# Altium schematic sheet v2.SchDoc
size A3
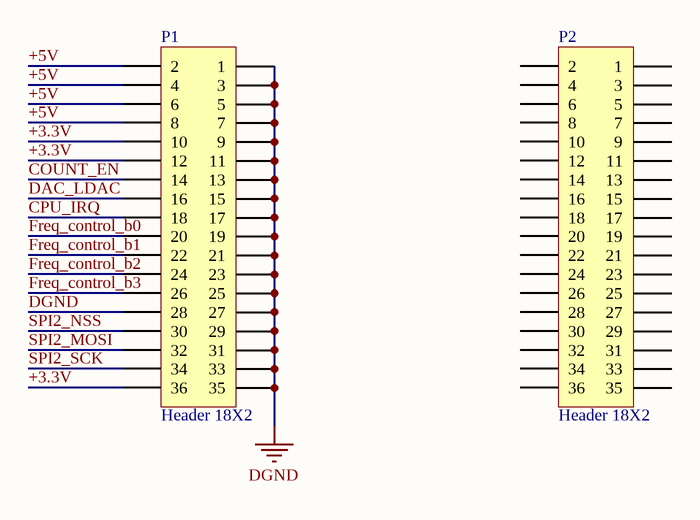
[diagram p0: v2.SchDoc]

## Parts
P1  Header 18X2  [HDR2X18]
P2  Header 18X2  [HDR2X18]

## Nets
DGND: P1.1 P1.3 P1.5 P1.7 P1.9 P1.11 P1.13 P1.15 P1.17 P1.19 P1.21 P1.23 P1.25 P1.27 P1.28 P1.29 P1.31 P1.33 P1.35
+3.3V: P1.10 P1.12 P1.36
+5V: P1.2 P1.4 P1.6 P1.8
COUNT_EN: P1.14
CPU_IRQ: P1.18
DAC_LDAC: P1.16
Freq_control_b0: P1.20
Freq_control_b1: P1.22
Freq_control_b2: P1.24
Freq_control_b3: P1.26
SPI2_MOSI: P1.32
SPI2_NSS: P1.30
SPI2_SCK: P1.34

Not connected (* = marked no-connect by the designer): P2 1 2 3 4 5 6 7 8 9 10 11 12 13 14 15 16 17 18 19 20 21 22 23 24 25 26 27 28 29 30 31 32 33 34 35 36

## Library data of the parts
P1 P2 = Header 18X2: Header, 18-Pin, Dual row; LatestRevisionDate: 17-Jul-2002; LatestRevisionNote: Re-released for DXP Platform.; Publisher: Altium Limited